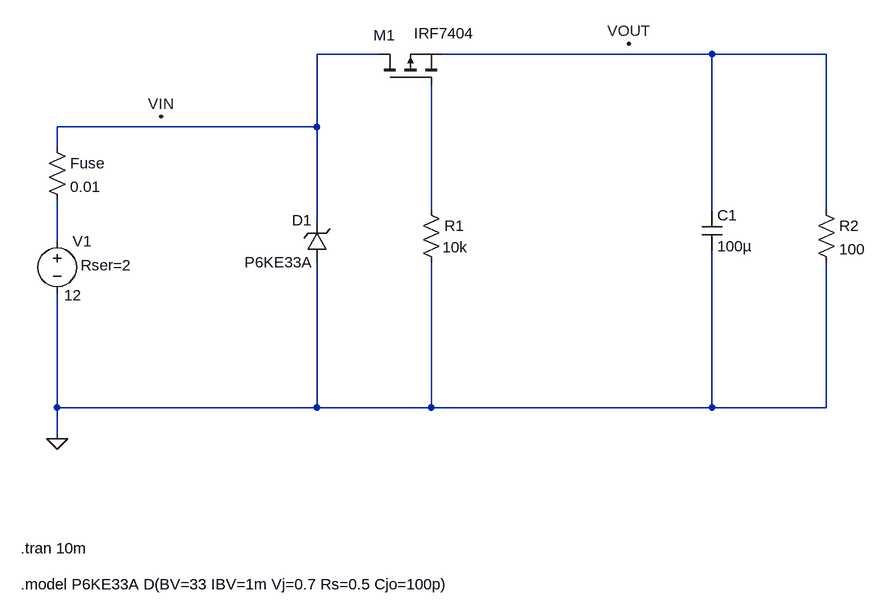
[diagram p0: schematic automotive_protection_circuit.asc]
automotive_protection_circuit.asc, the LTspice schematic file:
Version 4
SHEET 1 880 688
WIRE 96 -144 0 -144
WIRE 608 -144 192 -144
WIRE 784 -144 608 -144
WIRE 0 -32 0 -144
WIRE 0 -32 -400 -32
WIRE -400 0 -400 -32
WIRE 176 96 176 -96
WIRE 608 96 608 -144
WIRE 784 96 784 -144
WIRE 0 112 0 -32
WIRE -400 144 -400 80
WIRE -400 400 -400 224
WIRE 0 400 0 176
WIRE 0 400 -400 400
WIRE 176 400 176 176
WIRE 176 400 0 400
WIRE 608 400 608 160
WIRE 608 400 176 400
WIRE 784 400 784 176
WIRE 784 400 608 400
WIRE -400 448 -400 400
FLAG -400 448 0
FLAG -240 -48 VIN
FLAG 480 -160 VOUT
SYMBOL voltage -400 128 R0
WINDOW 3 11 99 Left 2
WINDOW 123 0 0 Left 0
WINDOW 39 36 53 Left 2
SYMATTR Value 12
SYMATTR SpiceLine Rser=2
SYMATTR InstName V1
SYMBOL res 160 80 R0
WINDOW 3 33 73 Left 2
SYMATTR Value 10k
SYMATTR InstName R1
SYMBOL zener 16 176 R180
WINDOW 0 24 64 Left 2
WINDOW 3 24 0 Left 2
SYMATTR InstName D1
SYMATTR Value P6KE33A
SYMATTR Description Diode
SYMATTR Type diode
SYMBOL pmos 96 -96 R270
WINDOW 0 77 -9 VRight 2
WINDOW 3 80 53 VRight 2
SYMATTR InstName M1
SYMATTR Value IRF7404
SYMBOL cap 592 96 R0
SYMATTR InstName C1
SYMATTR Value 100µ
SYMBOL res 768 80 R0
SYMATTR InstName R2
SYMATTR Value 100
SYMBOL res -416 -16 R0
SYMATTR InstName Fuse
SYMATTR Value 0.01
TEXT -456 616 Left 2 !.tran 10m
TEXT -456 672 Left 2 !.model P6KE33A D(BV=33 IBV=1m Vj=0.7 Rs=0.5 Cjo=100p)

The netlist it stands for:
* automotive_protection_circuit.asc
V1 N004 0 12 Rser=2
R1 N003 0 10k
D1 0 N001 P6KE33A
M1 N001 N003 N002 N002 IRF7404
C1 N002 0 100µ
R2 N002 0 100
R§Fuse N001 N004 0.01
.model D D
.lib standard.dio
.model NMOS NMOS
.model PMOS PMOS
.lib standard.mos
.tran 10m
.model P6KE33A D(BV=33 IBV=1m Vj=0.7 Rs=0.5 Cjo=100p)
.backanno
.end